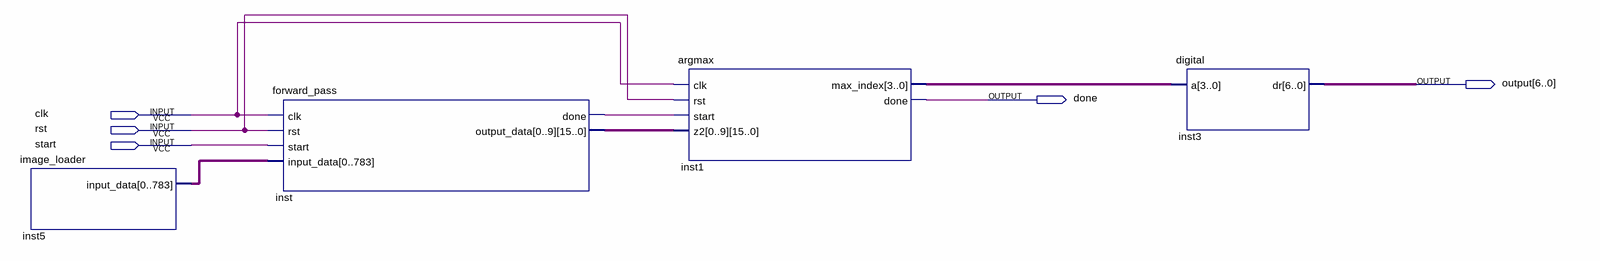
[diagram p0: schematic sheet]
// Quartus schematic mlp_verilog.bdf as structural Verilog: 4 symbols, 5 pins
module mlp_verilog (
  input  clk,
  input  rst,
  input  start,
  output [6:0] \output ,
  output done
);

  wire inst_done;
  wire [3:0] inst1_max_index;
  wire [159:0] inst_output_data;
  wire [783:0] inst5_input_data;

  image_loader inst5 (.input_data(inst5_input_data));
  forward_pass inst (
    .clk(clk), .rst(rst), .start(start), .input_data(inst5_input_data), .done(inst_done),
    .output_data(inst_output_data));
  argmax inst1 (
    .clk(clk), .rst(rst), .start(inst_done), .z2(inst_output_data), .max_index(inst1_max_index), .done(done));
  digital inst3 (.a(inst1_max_index), .dr(\output ));
endmodule
